# Altium schematic sheet 1_SWAP_21DD__LV_DR_BRUSH_REV1_0.schdoc.schdoc
size 553 x 228 mm
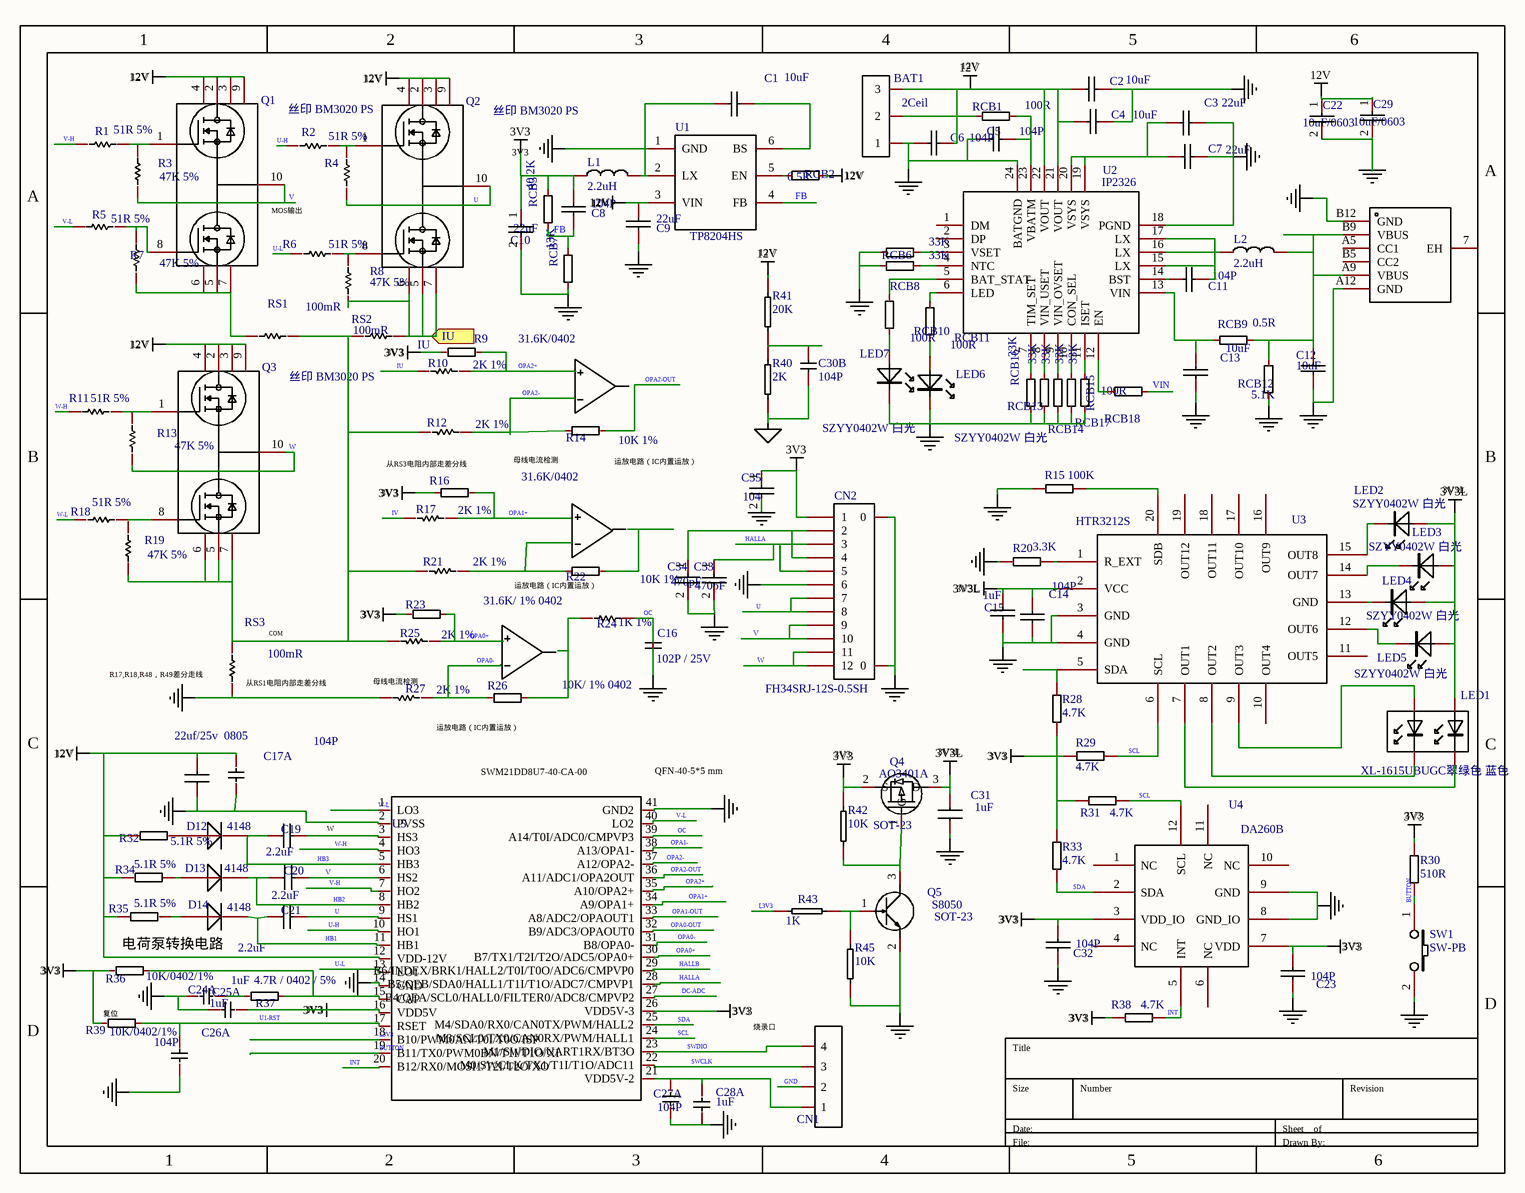
[diagram p0: 1_SWAP_21DD__LV_DR_BRUSH_REV1_0.schdoc.schdoc]

## Parts
BAT1  BAT  [HDR1X3]  (value not drawn)
C1  CC  [LC-0603_C]  (value not drawn)
C2  CC  [LC-0402_C]  (value not drawn)
C3  CC  [LC-0402_C]  (value not drawn)
C4  CC  [LC-0402_C]  (value not drawn)
C5  CC  [LC-0402_C]  (value not drawn)
C6  CC  [LC-0402_C]  (value not drawn)
C7  CC  [LC-0402_C]  (value not drawn)
C8  CC  [LC-0402_C]  (value not drawn)
C9  CC  [LC-0603_C]  (value not drawn)
C10  CC  [LC-0603_C]  (value not drawn)
C11  CC  [LC-0402_C]  (value not drawn)
C12  CC  [LC-0402_C]  (value not drawn)
C13  CC  [LC-0402_C]  (value not drawn)
C14  CC  [LC-0402_C]  (value not drawn)
C15  CC  [LC-0402_C]  (value not drawn)
C16  C0603  [LC-0402_C]  (value not drawn)
C17  CAP_S  [LC-0402_C]  (value not drawn)  (part A of 2)
C18  C0805  [LC-0603_C]  (value not drawn)
C19  C0805  [LC-0603_C]  (value not drawn)
C20  C0805  [LC-0603_C]  (value not drawn)
C21  C0805  [LC-0603_C]  (value not drawn)
C22  CC  [LC-0603_C]  (value not drawn)
C23  CC  [LC-0402_C]  (value not drawn)
C24  CAP_S  [LC-0402_C]  (value not drawn)  (part A of 2)
C25  CAP_S  [LC-0402_C]  (value not drawn)  (part A of 2)
C26  CAP_S  [LC-0402_C]  (value not drawn)  (part A of 2)
C27  CAP_S  [LC-0402_C]  (value not drawn)  (part A of 2)
C28  CAP_S  [LC-0402_C]  (value not drawn)  (part A of 2)
C29  CC  [LC-0603_C]  (value not drawn)
C30  CAP_S  [LC-0402_C]  (value not drawn)  (part B of 2)
C31  value 1uF  [LC-0402_C]  (hidden comment: CAPACITOR)
C32  CC  [LC-0402_C]  (value not drawn)
C33  CC  [LC-0402_C]  (value not drawn)
C34  CC  [LC-0402_C]  (value not drawn)
C35  CC  [LC-0402_C]  (value not drawn)
CN1  4P-2.54-8  [XH2.54-SMD4P]  (value not drawn)
CN2  CON12  [SMD-12]  (value not drawn)
D12  DIODE  [LC-SOD-323]  (value not drawn)
D13  DIODE  [LC-SOD-323]  (value not drawn)
D14  DIODE  [LC-SOD-323]  (value not drawn)
L1  L_-_5X4  [L1206A]  (value not drawn)
L2  L_-_5X4  [L1206]  (value not drawn)
LED1  LED-1  [LED0402-4]  (value not drawn)
LED2  LED  [LED0402]  (value not drawn)
LED3  LED  [LED0402]  (value not drawn)
LED4  LED  [LED0402]  (value not drawn)
LED5  LED  [LED0402]  (value not drawn)
LED6  LED  [LED0402]  (value not drawn)
LED7  LED  [LED0402]  (value not drawn)
Q1  CJBM3020  [DFN-3X3_8]  (value not drawn)
Q2  CJBM3020  [DFN-3X3_8]  (value not drawn)
Q3  CJBM3020  [DFN-3X3_8]  (value not drawn)
Q4  value AO3401A  PCB_DECAL: SOT-23  [LC-SOT-23(SOT-23-3)]  (hidden comment: PMOS_3)
Q5  value S8050  PCB_DECAL: SOT-23  [LC-SOT-23(SOT-23-3)]  (hidden comment: NPN)
R1  RES_SEMI  [LC-0402_R]  (value not drawn)
R2  RES_SEMI  [LC-0402_R]  (value not drawn)
R3  RES_SEMI  [LC-0402_R]  (value not drawn)
R4  RES_SEMI  [LC-0402_R]  (value not drawn)
R5  RES_SEMI  [LC-0402_R]  (value not drawn)
R6  RES_SEMI  [LC-0402_R]  (value not drawn)
R7  RES_SEMI  [LC-0402_R]  (value not drawn)
R8  RES_SEMI  [LC-0402_R]  (value not drawn)
R9  R0402  [LC-0402_R]  (value not drawn)
R10  RES_SEMI  [LC-0402_R]  (value not drawn)
R11  RES_SEMI  [LC-0402_R]  (value not drawn)
R12  RES_SEMI  [LC-0402_R]  (value not drawn)
R13  RES_SEMI  [LC-0402_R]  (value not drawn)
R14  R0402  [LC-0402_R]  (value not drawn)
R15  R  [LC-0402_R]  (value not drawn)
R16  R0402  [LC-0402_R]  (value not drawn)
R17  RES_SEMI  [LC-0402_R]  (value not drawn)
R18  RES_SEMI  [LC-0402_R]  (value not drawn)
R19  RES_SEMI  [LC-0402_R]  (value not drawn)
R20  R  [LC-0402_R]  (value not drawn)
R21  RES_SEMI  [LC-0402_R]  (value not drawn)
R22  R0402  [LC-0402_R]  (value not drawn)
R23  R0402  [LC-0402_R]  (value not drawn)
R24  RES_SEMI  [LC-0402_R]  (value not drawn)
R25  RES_SEMI  [LC-0402_R]  (value not drawn)
R26  R0402  [LC-0402_R]  (value not drawn)
R27  RES_SEMI  [LC-0402_R]  (value not drawn)
R28  R  [LC-0402_R]  (value not drawn)
R29  R  [LC-0402_R]  (value not drawn)
R30  R  [LC-0402_R]  (value not drawn)
R31  R  [LC-0402_R]  (value not drawn)
R32  RES_T  [LC-0402_R]  (value not drawn)
R33  R  [LC-0402_R]  (value not drawn)
R34  RES_T  [LC-0402_R]  (value not drawn)
R35  RES_T  [LC-0402_R]  (value not drawn)
R36  R0402  [LC-0402_R]  (value not drawn)
R37  R0402  [LC-0402_R]  (value not drawn)
R38  R  [LC-0402_R]  (value not drawn)
R39  R0402  [LC-0402_R]  (value not drawn)
R40  RES1  [LC-0402_R]  (value not drawn)
R41  RES1  [LC-0402_R]  (value not drawn)
R42  RES1  [LC-0402_R]  (value not drawn)
R43  RES1  [LC-0402_R]  (value not drawn)
R45  RES1  [LC-0402_R]  (value not drawn)
RCB1  RR  [LC-0402_R]  (value not drawn)
RCB2  RR  [LC-0402_R]  (value not drawn)
RCB3  RR  [LC-0402_R]  (value not drawn)
RCB6  RR  [LC-0402_R]  (value not drawn)
RCB7  RR  [LC-0402_R]  (value not drawn)
RCB8  RR  [LC-0402_R]  (value not drawn)
RCB9  RR  [LC-0402_R]  (value not drawn)
RCB10  RR  [LC-0402_R]  (value not drawn)
RCB11  RR  [LC-0402_R]  (value not drawn)
RCB12  RR  [LC-0402_R]  (value not drawn)
RCB13  RR  [LC-0402_R]  (value not drawn)
RCB14  RR  [LC-0402_R]  (value not drawn)
RCB15  RR  [LC-0402_R]  (value not drawn)
RCB16  RR  [LC-0402_R]  (value not drawn)
RCB17  RR  [LC-0402_R]  (value not drawn)
RCB18  RR  [LC-0402_R]  (value not drawn)
RS1  RES_2512  [LC-0805_R]  (value not drawn)
RS2  RES_2512  [LC-0805_R]  (value not drawn)
RS3  RES_2512  [LC-0805_R]  (value not drawn)
SW1  SW-PB  [SW_SMD-3_6_2.5]  (value not drawn)
U1  TP8204HS  [LC-SOT-23-6]  (value not drawn)
U2  IP2326  [QFN-24]  (value not drawn)
U3  HTR3212S  [QFN-20]  (value not drawn)
U4  DA260B  [LGA12]  (value not drawn)
U5  SWM21DD8U7  [QFN40]  (value not drawn)
USB1  TYPE-C_6P  [TYPE-C-SMD_6P]  (value not drawn)

## Ports
IU (in)

## Nets
3V3: C8.1 C10.1 C23.1 C25.1 C32.1 C35.1 CN2.1 L1.2 Q4.2(S) R9.2 R16.2 R23.2 R28.2 R29.1 R30.1 R31.1 R33.2 R36.1 R38.2 R39.1 R42.2 RCB3.2 U4.3(VDD_IO) U4.7(VDD) U5.16(VDD5V) U5.26(VDD5V-3)
3V3L: C14.1 C15.1 C31.1 LED1.3 LED2.1 LED3.1 LED4.1 LED5.1 Q4.3(D) U3.2(VCC)
12V: BAT1.3 C2.2 C4.2 C6.1 C9.1 C17.2 C18.2 C22.1 C29.1 Q1.2(D1) Q1.3(D1) Q1.4(D1) Q1.9(D1) Q2.2(D1) Q2.3(D1) Q2.4(D1) Q2.9(D1) Q3.2(D1) Q3.3(D1) Q3.4(D1) Q3.9(D1) R32.1 R34.1 R35.1 R41.2 RCB2.1 U1.3(VIN) U2.21(VOUT) U2.22(VOUT) U5.12(VDD-12V)
GND: BAT1.1 C2.1 C3.1 C4.1 C5.2 C6.2 C7.1 C9.2 C10.2 C12.2 C13.2 C14.2 C15.2 C16.1 C17.1 C18.1 C22.2 C23.2 C24.1 C25.2 C26.2 C27.1 C28.1 C29.2 C30.1 C31.2 C32.2 C33.2 C34.2 C35.2 CN1.2 CN2.0 CN2.6 LED6.2 LED7.2 Q5.2(E) R15.2 R20.2 R27.1 R40.1 R45.2 RCB6.2 RCB7.1 RCB8.2 RCB12.2 RCB13.2 RCB14.2 RCB15.2 RCB16.2 RCB17.2 RS3.1 SW1.2 U1.1(GND) U2.18(PGND) U2.24(BATGND) U3.3(GND) U3.4(GND) U4.8(GND_IO) U4.9(GND) U5.2(PVSS) U5.14(GND) U5.41(GND2) USB1.A12(GND) USB1.B12(GND)
BUTTON: R30.2 SW1.1 U5.19(B11/TX0/PWM0BN/T1I/T1O/XI)
DC-ADC: U5.27(B4/QEA/SCL0/HALL0/FILTER0/ADC8/CMPVP2)
FB: C8.2 RCB3.1 RCB7.2 U1.4(FB)
HALLA: C33.1 CN2.3 CN2.5 U5.28(B5/QEB/SDA0/HALL1/T1I/T1O/ADC7/CMPVP1)
HALLB: U5.29(B6/INDEX/BRK1/HALL2/T0I/T0O/ADC6/CMPVP0)
HB1: C21.1 D14.2(K) U5.11(HB1)
HB2: C20.1 D13.2(K) U5.8(HB2)
HB3: C19.1 D12.2(K) U5.5(HB3)
INT: R38.1 U4.5(INT) U5.20(B12/RX0/MOSI1/T2I/T2O/XO)
IU: Q2.5(S2) Q2.6(S2) Q2.7(S2) R8.1 R10.1 RS2.2 ; port IU
IV: R17.1
L3V3: R43.2 U5.18(B10/PWM0AN/T0I/T0O/ISP)
OC: C16.2 R24.2 U5.39(A14/T0I/ADC0/CMPVP3)
OPA0+: R23.1 R25.2 U5.30(B7/TX1/T2I/T2O/ADC5/OPA0+)
OPA0-: R26.2 R27.2 U5.31(B8/OPA0-)
OPA0-OUT: U5.32(B9/ADC3/OPAOUT0)
OPA1+: R16.1 R17.2 U5.34(A9/OPA1+)
OPA1-: U5.38(A13/OPA1-)
OPA1-OUT: U5.33(A8/ADC2/OPAOUT1)
OPA2+: R9.1 R10.2 U5.35(A10/OPA2+)
OPA2-: R12.2 R14.2 U5.37(A12/OPA2-)
OPA2-OUT: R14.1 U5.36(A11/ADC1/OPA2OUT)
SCL: R29.2 R31.2 U3.6(SCL) U4.12(SCL) U5.24(M3/SCL0/TX0/CAN0RX/PWM/HALL1)
SDA: R33.1 U4.2(SDA) U5.25(M4/SDA0/RX0/CAN0TX/PWM/HALL2)
SWCLK: CN1.3 U5.22(M0/SWCLK/TX1/T1I/T1O/ADC11)
SWDIO: CN1.4 U5.23(M1/SWDIO/UART1RX/BT3O)
U: C21.2 CN2.7 CN2.8 Q2.10(S1/D2) R4.2 U5.9(HS1)
U1-RST: C26.1 R39.2 U5.17(RSET)
U-H: R2.1 U5.10(HO1)
U-L: R6.1 U5.13(LO1)
V: C20.2 CN2.9 CN2.10 Q1.10(S1/D2) R3.1 U5.6(HS2)
V-H: R1.1 U5.7(HO2)
V-L: R5.1 U5.40(LO2)
VIN: RCB18.2
W: CN2.11 CN2.12 Q3.10(S1/D2) R13.1
W-H: R11.1 U5.4(HO3)
W-L: R18.1 U5.1(LO3)
NetBAT1_2: BAT1.2 RCB1.2
NetC1_1: C1.1 L1.1 U1.2(LX)
NetC1_2: C1.2 U1.6(BS)
NetC3_2: C3.2 C7.2 U2.19(VSYS) U2.20(VSYS)
NetC5_1: C5.1 RCB1.1 U2.23(VBATM)
NetC11_1: C11.1 U2.14(BST)
NetC11_2: C11.2 L2.2 U2.15(LX) U2.16(LX) U2.17(LX)
NetC12_1: C12.1 L2.1 RCB9.2 RCB12.1 USB1.A9(VBUS) USB1.B9(VBUS)
NetC13_1: C13.1 RCB9.1 U2.13(VIN)
NetC19_2: C19.2 U5.3(HS3)
NetC24_2: C24.2 R37.1
NetC27_2: C27.2 C28.2 CN1.1 U5.21(VDD5V-2)
NetC30_2: C30.2 R40.2 R41.1
NetC34_1: C34.1 CN2.2 CN2.4
NetD12_1: D12.1(A) R32.2
NetD13_1: D13.1(A) R34.2
NetD14_1: D14.1(A) R35.2
NetLED1_1: LED1.1 U3.8(OUT2)
NetLED1_2: LED1.2 U3.7(OUT1)
NetLED1_4: LED1.4 U3.9(OUT3)
NetLED2_2: LED2.2 U3.15(OUT8)
NetLED3_2: LED3.2 U3.14(OUT7)
NetLED4_2: LED4.2 U3.13(GND)
NetLED5_2: LED5.2 U3.12(OUT6)
NetLED6_1: LED6.1 RCB11.1
NetLED7_1: LED7.1 RCB10.1
NetQ1_1: Q1.1(G1) R1.2 R3.2
NetQ1_5: Q1.5(S2) Q1.6(S2) Q1.7(S2) R7.1 RS1.2
NetQ1_8: Q1.8(G2) R5.2 R7.2
NetQ2_1: Q2.1(G1) R2.2 R4.1
NetQ2_8: Q2.8(G2) R6.2 R8.2
NetQ3_1: Q3.1(G1) R11.2 R13.2
NetQ3_5: Q3.5(S2) Q3.6(S2) Q3.7(S2) R12.1 R19.1 R21.1 R25.1 RS1.1 RS2.1 RS3.2
NetQ3_8: Q3.8(G2) R18.2
NetQ4_1: Q4.1(G) Q5.3(C) R42.1
NetQ5_1: Q5.1(B) R43.1 R45.1
NetR15_1: R15.1 U3.20(SDB)
NetR20_1: R20.1 U3.1(R_EXT)
NetR21_2: R21.2 R22.2
NetR24_1: R24.1 R26.1
NetR28_1: R28.1 U3.5(SDA)
NetR36_2: R36.2 R37.2 U5.15(CAP)
NetRCB2_2: RCB2.2 U1.5(EN)
NetRCB6_1: RCB6.1 U2.3(VSET)
NetRCB8_1: RCB8.1 U2.4(NTC)
NetRCB10_2: RCB10.2 U2.5(BAT_STAT)
NetRCB11_2: RCB11.2 U2.6(LED)
NetRCB13_1: RCB13.1 U2.8(VIN_USET)
NetRCB14_1: RCB14.1 U2.9(VIN_OVSET)
NetRCB15_1: RCB15.1 U2.11(ISET)
NetRCB16_1: RCB16.1 U2.7(TIM_SET)
NetRCB17_1: RCB17.1 U2.10(CON_SEL)
NetRCB18_1: RCB18.1 U2.12(EN)

Not connected (* = marked no-connect by the designer): R19 2; R22 1; U2 1(DM) 2(DP); U3 10(OUT4) 11(OUT5) 16(OUT9) 17(OUT10) 18(OUT11) 19(OUT12); U4 1(NC) 4(NC) 6(NC) 10(NC) 11(NC); USB1 7(EH) A5(CC1) B5(CC2)

## Notes on the sheet
- 1
- (near Q1) 12V
- (near Q2) 12V
- 2
- 3
- (near BAT1) 4
- 12V
- 5
- 6
- 3V3
- A
- (near Q1) MOS输出
- (near Q3) 12V
- (near RS2) 3V3
- B
- 从RS3电阻内部走差分线
- 母线电流检测
- (near R14) 运放电路（IC内置运放）
- (near LED2) 3V3L
- (near RS3) COM
- (near R22) 运放电路（IC内置运放）
- 3V3L
- (near RS3) R17,R18,R48，R49差分走线
- (near RS3) 从RS1电阻内部走差分线
- (near R27) 母线电流检测
- C
- 运放电路（IC内置运放）
- (near LED1) C
- (near C19) W
- (near U5) SWM21DD8U7-40-CA-00
- (near U5) QFN-40-5*5 mm
- (near R30) 3V3
- 电荷泵转换电路
- D
- (near R39) 复位
- (near R37) 3V3
- (near CN1) 烧录口
- Title
- (near R38) 3V3
- Size
- Number
- Revision
- 4
- File:
- Date:
- Sheet    of
- Drawn By:

## Library data of the parts
BAT1 = BAT: Connector; Add into BOM: yes; Name: BAT; Symbol: BAT; Device: BAT; OldName: BAT; PCB DECAL: HDR1X3; Convert to PCB: yes; Origin Footprint: HDR1X3
C1 C5 C6 C8-C15 C22 C23 C29 C32-C35 = CC: Capacitor; PCB_DECAL: C0603; Add into BOM: yes; Name: CC; Symbol: CC; Device: CC; OldName: CC; Convert to PCB: yes
  C1 C9 C10 C22 C29: PCB DECAL: LC-0603_C; Origin Footprint: LC-0603_C
  C5 C6 C8 C11-C15 C23 C32-C35: PCB DECAL: LC-0402_C; Origin Footprint: LC-0402_C
C2-C4 C7 = CC: Capacitor; PCB_DECAL: C0603; PCB DECAL: LC-0603_C; Add into BOM: yes; Name: CC; Symbol: CC; Device: CC; OldName: CC; Convert to PCB: yes; Origin Footprint: LC-0603_C
C16 = C0603: 贴片瓷片电容; Value: 100nF; Add into BOM: yes; Name: C0603; Symbol: C0603; Device: C0603; OldName: C0603; Published: 8-Jun-2000; LatestRevisionDate: 17-Jul-2002; LatestRevisionNote: Re-released for DXP Platform.; PackageReference: RAD-0.3; Publisher: Altium Limited; PCB_DECAL: C0603; Comment_1: C0603; PCB DECAL: LC-0402_C; Convert to PCB: yes; Origin Footprint: LC-0402_C
C17 C24-C28 C30 = CAP_S: PCB_DECAL: C0603; Add into BOM: yes; Name: CAP_S; Symbol: CAP_S; Device: CAP_S; OldName: CAP_S; Comment_1: CAP_S; PCB DECAL: LC-0402_C; Convert to PCB: yes; Origin Footprint: LC-0402_C
C18-C21 = C0805: SMT Resistor 5% UniOhm(厚声); Part_Shape: 0603; Source_Path: E:\GTCS-A01-SWM-P9项目\GTCS-A01-SWM-P9项目V1.2\GTCS-A01-SWM-P9-V1.2.原理图\99.DSN; ValueRank: 33R; ForPin: Pin; Add into BOM: yes; Name: C0805; Symbol: C0805; Device: C0805; OldName: C0805; Published: 8-Jun-2000; LatestRevisionDate: 17-Jul-2002; LatestRevisionNote: Re-released for DXP Platform.; PackageReference: 0805; Publisher: Altium Limited; PackageDescription: Radial Cap, Thru-Hole; 2 Leads; 0.3 in Pin Spacing; PCB_DECAL: C0805; MountType: SMT; Accuracy: 5%; Comment_1: C0805; PCB DECAL: LC-0603_C; Convert to PCB: yes; Origin Footprint: LC-0603_C
C31 = CAPACITOR: Source_Path: F:\T2700\LIBRARY1.OLB; Add into BOM: yes; Name: CAPACITOR; Symbol: CAPACITOR; Device: CAPACITOR; OldName: CAPACITOR; PCB DECAL: LC-0402_C; Convert to PCB: yes; Origin Footprint: LC-0402_C
CN1 = 4P-2.54-8: 接插件  DS-5.1CN4  DS-2.54CWB-4; Add into BOM: yes; Name: 4P-2.54-8; Symbol: 4P-2.54-8; Device: 4P-2.54-8; OldName: 4P-2.54-8; PCB_DECAL: 4P-2.54-8; Comment_1: 4P-2.54-8; PCB DECAL: XH2.54-SMD4P; Convert to PCB: yes; Origin Footprint: XH2.54-SMD4P
CN2 = CON12: Connector; Add into BOM: yes; Name: CON12; Symbol: CON12; Device: CON12; OldName: CON12; PCB DECAL: SMD-12; Convert to PCB: yes; Origin Footprint: SMD-12
D12-D14 = DIODE: Default Diode; PCB_DECAL: SOD-123/3; Add into BOM: yes; Name: DIODE; Symbol: DIODE; Device: DIODE; OldName: DIODE; Published: 8-Jun-2000; LatestRevisionDate: 17-Jul-2002; LatestRevisionNote: Re-released for DXP Platform.; PackageVersion: Sep-1996; PackageReference: SMC; Publisher: Altium Limited; PackageDescription: DO-214-AB/SMC; 2 C-Bend Leads; Body 7.9 x 5.9 mm, inc. leads (LxW); Code_JEDEC: DO-214-AB; Comment_1: DIODE; PCB DECAL: LC-SOD-323; Convert to PCB: yes; Origin Footprint: LC-SOD-323
L1 = L_-_5X4: 电感; PCB DECAL: L_0805; Add into BOM: yes; Name: L_-_5X4; Symbol: L_-_5X4; Device: L_-_5X4; OldName: L_-_5X4; Convert to PCB: yes; Origin Footprint: L_0805
L2 = L_-_5X4: 电感; Add into BOM: yes; Name: L_-_5X4; Symbol: L_-_5X4; Device: L_-_5X4; OldName: L_-_5X4; PCB DECAL: L1206; Convert to PCB: yes; Origin Footprint: L1206
LED1 = LED-1: Add into BOM: yes; Name: LED-1; Symbol: LED-1; Device: LED-1; OldName: LED-1; PCB DECAL: LED0402-4; Convert to PCB: yes; Origin Footprint: LED0402-4
LED2-LED7 = LED: Add into BOM: yes; Name: LED; Symbol: LED; Device: LED; OldName: LED; PCB DECAL: LED0402; Convert to PCB: yes; Origin Footprint: LED0402
Q1-Q3 = CJBM3020: Add into BOM: yes; Name: CJBM3020; Symbol: CJBM3020; Device: CJBM3020; OldName: CJBM3020; PCB DECAL: DFN-3X3_8; Convert to PCB: yes; Origin Footprint: DFN-3X3_8
Q4 = PMOS_3: Source_Path: F:\T27XX\MAIN BOARD\T27XX_MAIN_V0D0_20211205.DSN; Add into BOM: yes; Name: PMOS_3; Symbol: PMOS_3; Device: PMOS_3; OldName: PMOS_3; PCB DECAL: LC-SOT-23(SOT-23-3); Convert to PCB: yes; Origin Footprint: LC-SOT-23(SOT-23-3)
Q5 = NPN: Source_Path: F:\T2700\LIBRARY1.OLB; PCB DECAL: SOT-723; Add into BOM: yes; Name: NPN; Symbol: NPN; Device: NPN; OldName: NPN; Convert to PCB: yes; Origin Footprint: SOT-723
R1-R8 R10-R13 R17-R19 R21 R24 R25 R27 = RES_SEMI: Semiconductor Resistor; Value: 1K; PCB_DECAL: R0603; Add into BOM: yes; Name: RES_SEMI; Symbol: RES_SEMI; Device: RES_SEMI; OldName: RES_SEMI; Published: 8-Jun-2000; LatestRevisionDate: 17-Jul-2002; LatestRevisionNote: Re-released for DXP Platform.; PackageReference: AXIAL-0.5; Publisher: Altium Limited; PackageDescription: Axial Device, Thru-Hole; 2 Leads; 0.5 in Pin Spacing; Comment_1: RES_SEMI; PCB DECAL: LC-0402_R; Convert to PCB: yes; Origin Footprint: LC-0402_R
R9 R14 R16 R22 R23 R26 R36 R37 R39 = R0402: 贴片电阻; Value: 1K; PCB_DECAL: R0603; Add into BOM: yes; Name: R0402; Symbol: R0402; Device: R0402; OldName: R0402; Published: 8-Jun-2000; LatestRevisionDate: 17-Jul-2002; LatestRevisionNote: Re-released for DXP Platform.; Publisher: Altium Limited; Comment_1: R0402; PCB DECAL: LC-0402_R; Convert to PCB: yes; Origin Footprint: LC-0402_R
  R9 R14 R16 R22 R23 R26: PackageReference: AXIAL-0.5; PackageDescription: Axial Device, Thru-Hole; 2 Leads; 0.5 in Pin Spacing
  R36 R37 R39: PackageReference: AXIAL-0.4
R15 R20 R28-R31 R33 R38 = R: Resistance; Add into BOM: yes; Name: R; Symbol: R; Device: R; OldName: R; PCB DECAL: LC-0402_R; Convert to PCB: yes; Origin Footprint: LC-0402_R
R32 R34 R35 = RES_T: PCB_DECAL: R1206; Add into BOM: yes; Name: RES_T; Symbol: RES_T; Device: RES_T; OldName: RES_T; Comment_1: RES_T; PCB DECAL: LC-0402_R; Convert to PCB: yes; Origin Footprint: LC-0402_R
R40-R43 R45 = RES1: Add into BOM: yes; Name: RES1; Symbol: RES1; Device: RES1; OldName: RES1; PCB DECAL: LC-0402_R; Convert to PCB: yes; Origin Footprint: LC-0402_R
RCB1-RCB3 RCB6-RCB18 = RR: 贴片 电阻器; Value: 1K; PCB_DECAL: R0603; SMD/DIP/WELDING: SMD; Add into BOM: yes; Name: RR; Symbol: RR; Device: RR; OldName: RR; Published: 8-Jun-2000; LatestRevisionDate: 17-Jul-2002; LatestRevisionNote: Re-released for DXP Platform.; PackageReference: AXIAL-0.5; Publisher: Altium Limited; PackageDescription: Axial Device, Thru-Hole; 2 Leads; 0.5 in Pin Spacing; PCB DECAL: LC-0402_R; Convert to PCB: yes; Origin Footprint: LC-0402_R
RS1-RS3 = RES_2512: Semiconductor Resistor; Value: 1K; PCB_DECAL: 2512R_6332; Add into BOM: yes; Name: RES_2512; Symbol: RES_2512; Device: RES_2512; OldName: RES_2512; Published: 8-Jun-2000; LatestRevisionDate: 17-Jul-2002; LatestRevisionNote: Re-released for DXP Platform.; PackageReference: AXIAL-0.5; Publisher: Altium Limited; PackageDescription: Axial Device, Thru-Hole; 2 Leads; 0.5 in Pin Spacing; Comment_1: RES_2512; PCB DECAL: LC-0805_R; Convert to PCB: yes; Origin Footprint: LC-0805_R
SW1 = SW-PB: Add into BOM: yes; Name: SW-PB; Symbol: SW-PB; Device: SW-PB; OldName: SW-PB; PCB DECAL: SW_SMD-3_6_2.5; Convert to PCB: yes; Origin Footprint: SW_SMD-3_6_2.5
U1 = TP8204HS: Add into BOM: yes; Name: TP8204HS; Symbol: TP8204HS; Device: TP8204HS; OldName: TP8204HS; PCB DECAL: LC-SOT-23-6; Convert to PCB: yes; Origin Footprint: LC-SOT-23-6
U2 = IP2326: Add into BOM: yes; Name: IP2326; Symbol: IP2326; Device: IP2326; OldName: IP2326; PCB DECAL: QFN-24; Convert to PCB: yes; Origin Footprint: QFN-24
U3 = HTR3212S: Add into BOM: yes; Name: HTR3212S; Symbol: HTR3212S; Device: HTR3212S; OldName: HTR3212S; PCB DECAL: QFN-20; Convert to PCB: yes; Origin Footprint: QFN-20
U4 = DA260B: Add into BOM: yes; Name: DA260B; Symbol: DA260B; Device: DA260B; OldName: DA260B; PCB DECAL: LGA12; Convert to PCB: yes; Origin Footprint: LGA12
U5 = SWM21DD8U7: PCB_DECAL: SWM21DK6U7_QFN32_5X5_BA00; Add into BOM: yes; Name: SWM21DD8U7; Symbol: SWM21DD8U7; Device: SWM21DD8U7; OldName: SWM21DD8U7; Description: SWM21DD8U7; PCB DECAL: QFN40; Convert to PCB: yes; Origin Footprint: QFN40
USB1 = TYPE-C_6P: Manufacturer: SHOU HAN(首韩); Manufacturer_Part: TYPE-C 6P(073); Add into BOM: yes; Connector_Type: Type-C; Gender: 母; Number_of_Ports: 1; Number_of_Contacts: 6P; Mounting_Style: 卧贴; Current_Rating___Power_(Max): 5A; Operating_Temperature_Range: -25℃~+85℃; Symbol: TYPE-C_6P; Device: TYPE-C_6P; OldName: TYPE-C_6P; Supplier: LCSC; Supplier_Part: C668623; JLCPCB_Part_Class: Extended Part; LCSC_Part_Name: Type-C 母 卧贴; Supplier_Footprint: SMD; Datasheet: https://atta.szlcsc.com/upload/public/pdf/source/20200618/C668623_A4B260DED7AC1949BAC6AE39E9F4CD80.pdf; Convert to PCB: yes; Standard: -; PCB DECAL: TYPE-C-SMD_6P; Origin Footprint: TYPE-C-SMD_6P